# Altium schematic sheet analogPWM.SchDoc
size A
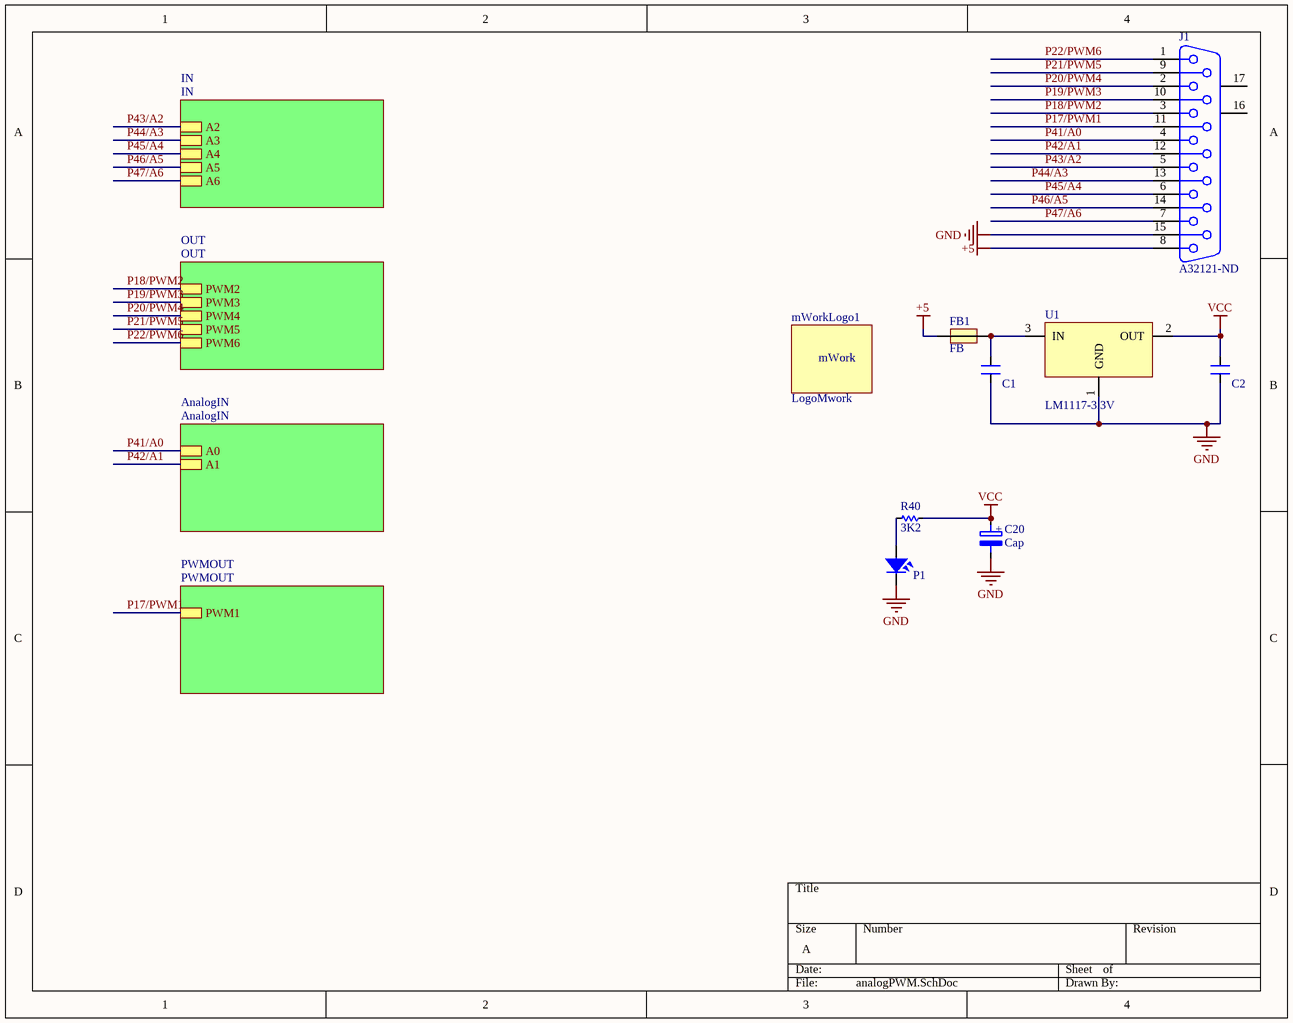
[diagram p0: analogPWM.SchDoc]

## Parts
C1  100nF  [CN-SMD-0805]  (value not drawn)
C2  100nF  [CN-SMD-0805]  (value not drawn)
C20  Cap  [Cap_C]
FB1  FB  [Capacitor_805]
J1  A32121-ND  [DB15]
mWorkLogo1  LogoMwork  [LogoMwork15*6]
P1  LED  [LED-0805-Green]  (value not drawn)
R40  3K2  [RES-SMD-0805]
U1  LM1117-3.3V  [SOT223]

## Sub-sheets
AnalogIN = AnalogIN: A0, A1
IN = IN: A2, A3, A4, A5, A6
OUT = OUT: PWM2, PWM3, PWM4, PWM6, PWM5
PWMOUT = PWMOUT: PWM1

## Nets
+5: FB1.1 J1.8
GND: C1.2 C2.2 C20.2 J1.15 P1.2 U1.1(GND)
VCC: C2.1 C20.1 R40.1 U1.2(OUT)
P17/PWM1: J1.11 ; sheet PWMOUT/PWM1
P18/PWM2: J1.3 ; sheet OUT/PWM2
P19/PWM3: J1.10 ; sheet OUT/PWM3
P20/PWM4: J1.2 ; sheet OUT/PWM4
P21/PWM5: J1.9 ; sheet OUT/PWM5
P22/PWM6: J1.1 ; sheet OUT/PWM6
P41/A0: J1.4 ; sheet AnalogIN/A0
P42/A1: J1.12 ; sheet AnalogIN/A1
P43/A2: J1.5 ; sheet IN/A2
P44/A3: J1.13 ; sheet IN/A3
P45/A4: J1.6 ; sheet IN/A4
P46/A5: J1.14 ; sheet IN/A5
P47/A6: J1.7 ; sheet IN/A6
NetC1_1: C1.1 FB1.2 U1.3(IN)
NetP1_1: P1.1 R40.2

Not connected (* = marked no-connect by the designer): J1 16(MH1) 17(MH2)

## Notes on the sheet
- (in symbol Cap_tan) +
- (in symbol LogoMwork) mWork

## Library data of the parts
C1 C2 = CN: Value: 33pF
C20 = Cap_tan: Polarized Capacitor (Radial)
J1 = DB15: Receptacle Assembly, 15 Position, Right Angle; PackageDocument: O; Positions: 15; Published: 15-Jun-2001; LatestRevisionDate: 17-Jul-2002; LatestRevisionNote: Re-released for DXP Platform.; DatasheetDocument: 1-Sep-99; PackageReference: 788757; Publisher: Altium Limited; Orientation: Right Angle; Gender: Receptacle
P1 = LED SMD: Value: LED 3 - 5 ly 2 Colour
R40 = R
U1 = LM1117: 800mA Low-Dropout Linear Regulator; Creator: Nguyen Ba Bien; Website: http://group3i.net